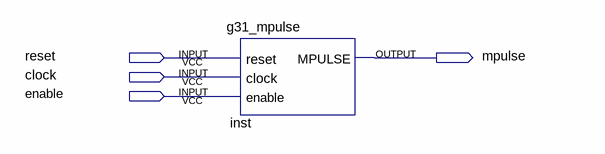
[diagram p0: schematic sheet]
// Quartus schematic g31_mpulse_circuit.bdf as structural Verilog: 1 symbols, 4 pins
module g31_mpulse_circuit (
  input  reset,
  input  clock,
  input  enable,
  output mpulse
);

  g31_mpulse inst (.reset(reset), .clock(clock), .enable(enable), .MPULSE(mpulse));
endmodule
